# Altium schematic sheet 04 POWER.SchDoc
size 420 x 297 mm
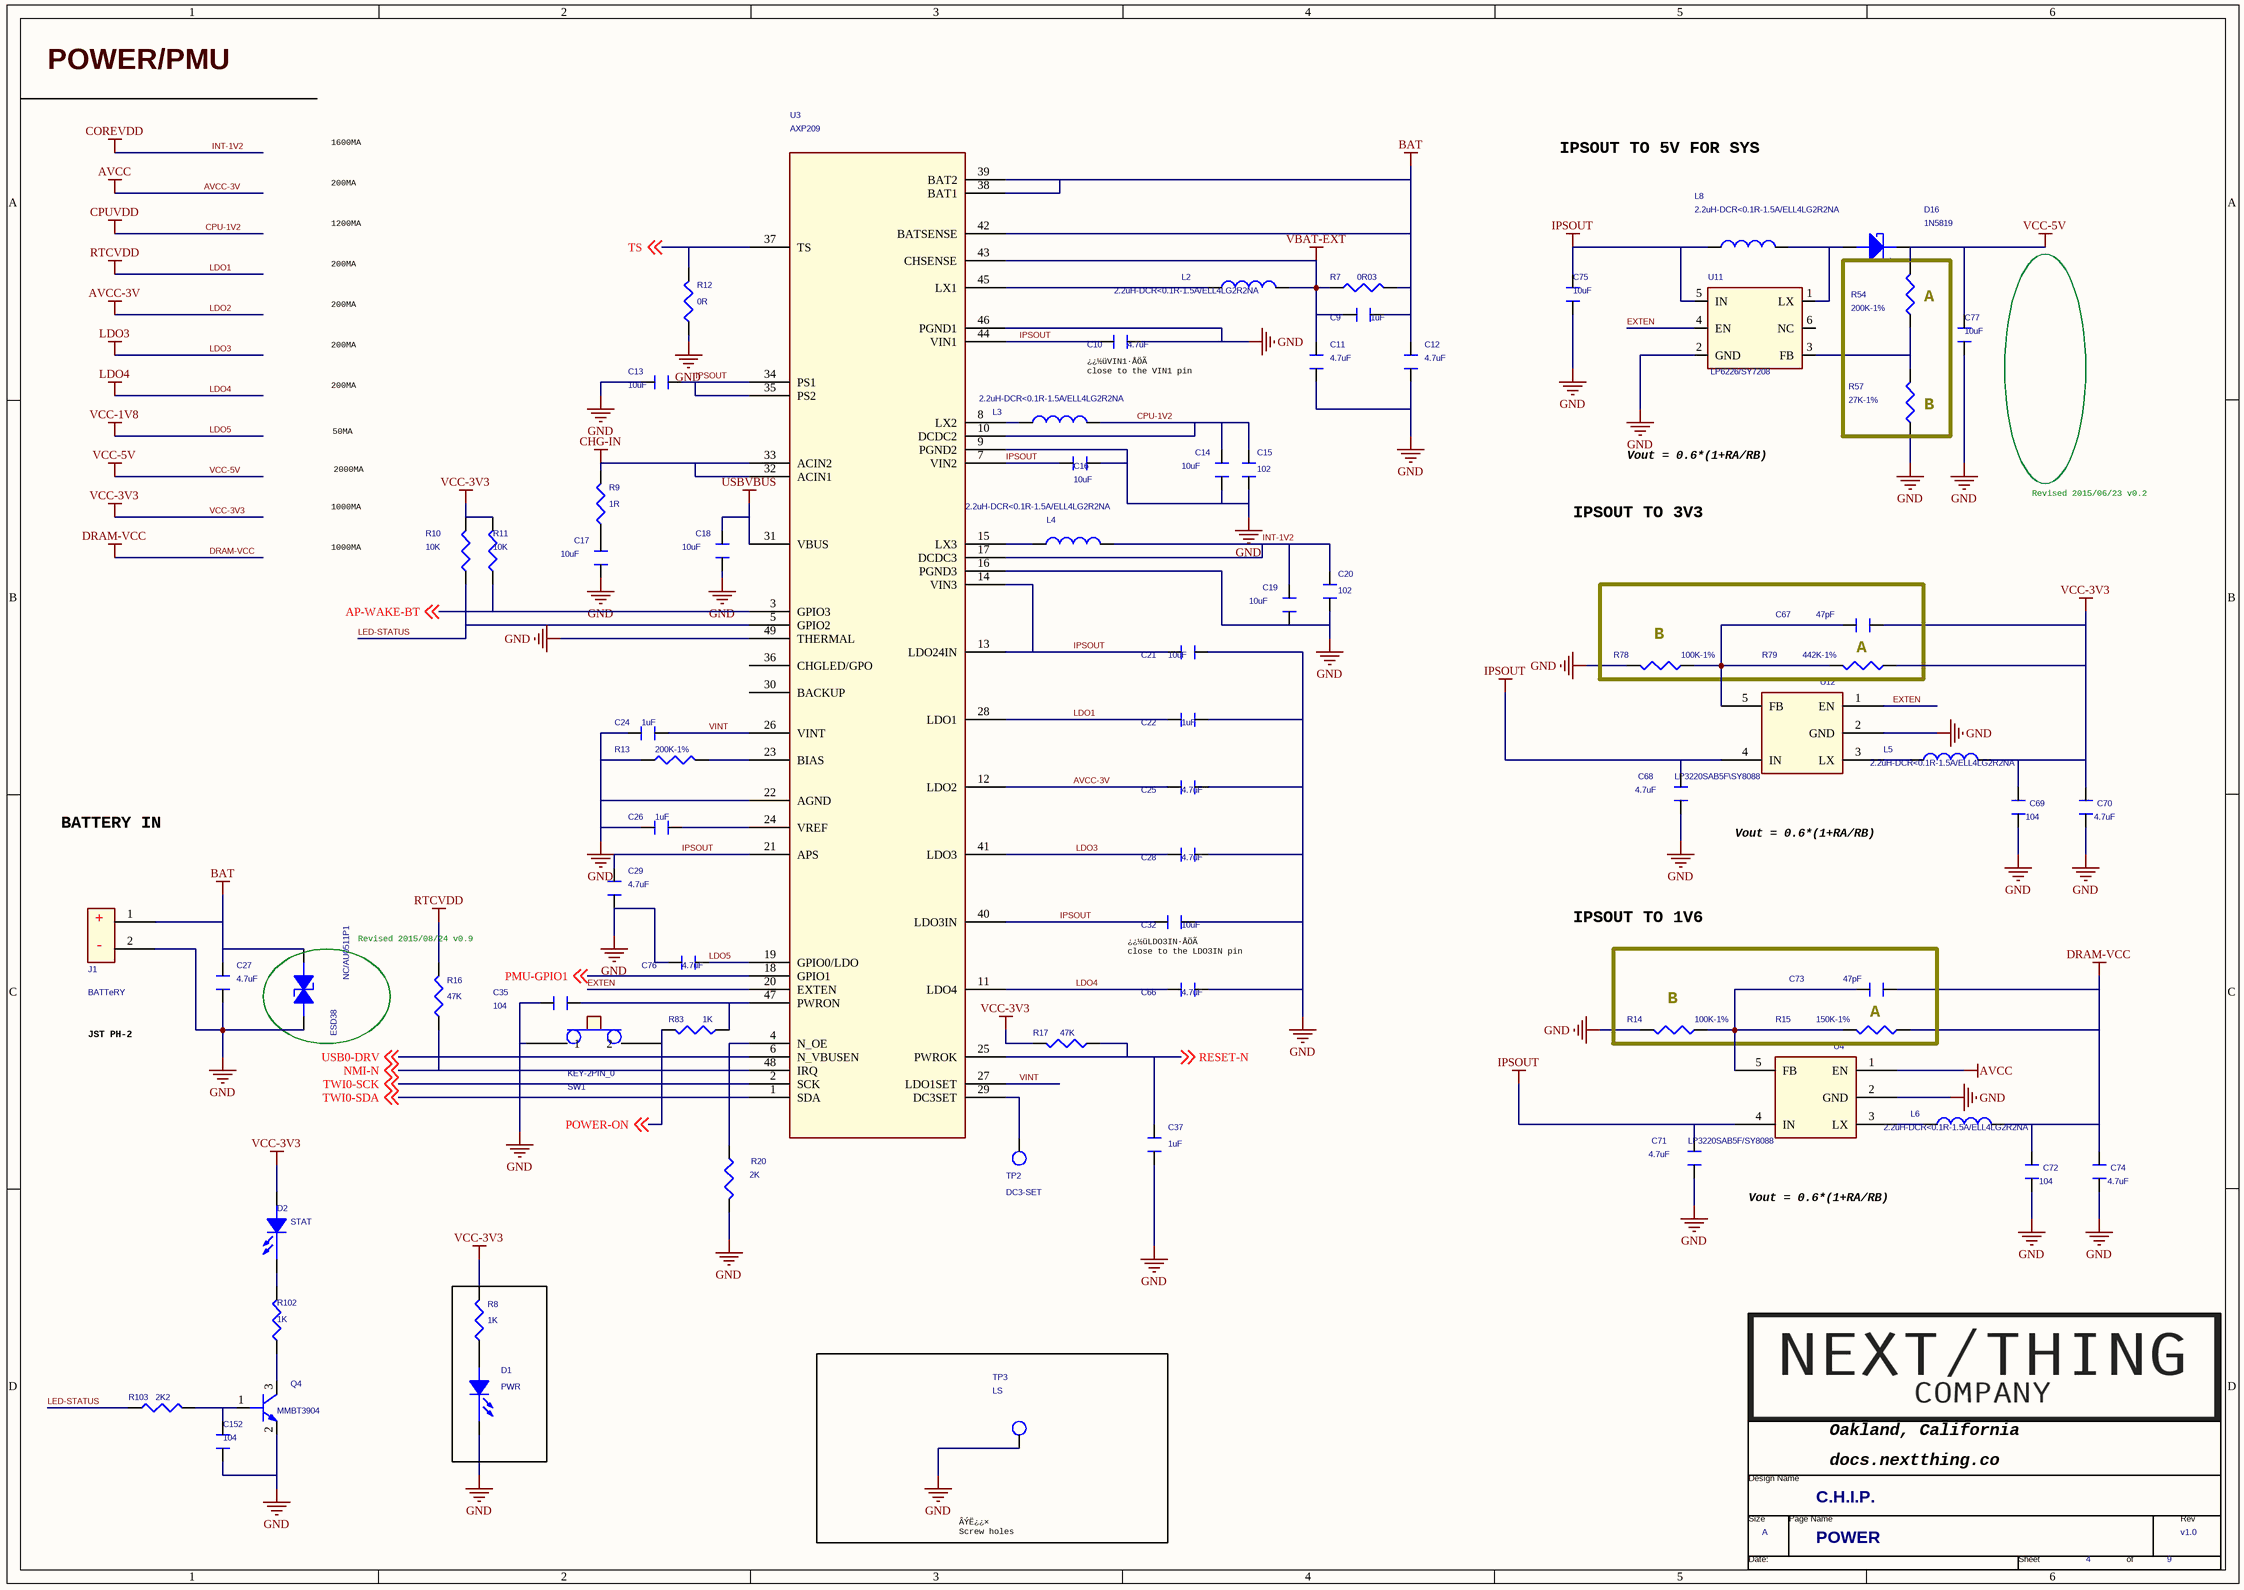
[diagram p0: 04 POWER.SchDoc]

## Parts
*  Page Count: 9  Page Number: 4  Page Size: A  Title: C.H.I.P.  RevCode: v1.0  Doc: POWER  (hidden comment: TitleBlock1-nextthing)  (graphical)
C9  1uF  [CC0402]
C10  4.7uF  [Cc0603]
C11  4.7uF  [CC0603]
C12  4.7uF  [CC0603]
C13  10uF  [CC0603]
C14  10uF  [CC0603]
C15  102  [CC0402]
C16  10uF  [CC0603]
C17  10uF  [CC0603]
C18  10uF  [CC0603]
C19  10uF  [CC0603]
C20  102  [C0201]
C21  10uF  [CC0603]
C22  1uF  [CC0402]
C24  1uF  [CC0402]
C25  4.7uF  [CC0603]
C26  1uF  [CC0402]
C27  4.7uF  [CC0603]
C28  4.7uF  [CC0603]
C29  4.7uF  [CC0603]
C32  10uF  [CC0603]
C35  104  [C0201]
C37  1uF  [CC0402]
C66  4.7uF  [CC0603]
C67  47pF  [C0201]
C68  4.7uF  [CC0603]
C69  104  [C0201]
C70  4.7uF  [CC0603]
C71  4.7uF  [CC0603]
C72  104  [C0201]
C73  47pF  [C0201]
C74  4.7uF  [CC0603]
C75  10uF  [CC0603]
C76  4.7uF  [CC0603]
C77  10uF  [CC0603]
C152  104  [C0201]
D1  PWR  [D0603]
D2  STAT  [D0603]
D16  1N5819  [SOD123]
ESD38  NC/AU0511P1  [R0402]
J1  BATTeRY  [CON2-PT2-6X6H4_7B]
L2  2.2uH-DCR<0.1R-1.5A/ELL4LG2R2NA  [L3518]
L3  2.2uH-DCR<0.1R-1.5A/ELL4LG2R2NA  [L3518]
L4  2.2uH-DCR<0.1R-1.5A/ELL4LG2R2NA  [L3518]
L5  2.2uH-DCR<0.1R-1.5A/ELL4LG2R2NA  [L3518]
L6  2.2uH-DCR<0.1R-1.5A/ELL4LG2R2NA  [L3518]
L8  2.2uH-DCR<0.1R-1.5A/ELL4LG2R2NA  [L3518]
Q4  MMBT3904  [SOT-23]
R7  0R03  [R0805]
R8  1K  [C0201]
R9  1R  [R0402]
R10  10K  [C0201]
R11  10K  [C0201]
R12  0R  [C0201]
R13  200K-1%  [C0201]
R14  100K-1%  [R0402]
R15  150K-1%  [R0402]
R16  47K  [C0201]
R17  47K  [C0201]
R20  2K  [C0201]
R54  200K-1%  [C0201]
R57  27K-1%  [C0201]
R78  100K-1%  [R0402]
R79  442K-1%  [R0402]
R83  1K  [C0201]
R102  1K  [C0201]
R103  2K2  [C0201]
SW1  KEY-2PIN_0  [KEY-2]
TP2  DC3-SET  [TP40_SMD]
TP3  LS  [PAD5_5D3]
U3  AXP209  [QFN49_0_4H0_8A]
U4  LP3220SAB5F/SY8088  [TSOT-23-6]
U11  LP6226/SY7208  [SOT23-6]
U12  LP3220SAB5F\SY8088  [TSOT-23-6]

## Nets
AVCC-3V: C25.1 U3.12(LDO2) U4.1(EN)  [also labelled AVCC, LDO2]
BAT: C9.2 C12.1 C27.2 ESD38.1(ANODE) J1.1 R7.1 U3.38(BAT1) U3.39(BAT2) U3.42(BATSENSE)
CHG-IN: R9.2 U3.32(ACIN1) U3.33(ACIN2)
CPU-1V2: C14.1 C15.1 L3.1 U3.10(DCDC2)  [also labelled CPUVDD]
DRAM-VCC: C72.1 C73.1 C74.1 L6.1 R15.2
GND: C10.2 C11.2 C12.2 C13.1 C14.2 C15.2 C16.2 C17.2 C18.2 C19.2 C20.2 C21.2 C22.1 C24.2 C25.2 C26.1 C27.1 C28.1 C29.2 C32.2 C35.1 C37.1 C66.1 C68.2 C69.2 C70.2 C71.2 C72.2 C74.2 C75.2 C76.2 C77.2 C152.1 D1.2(CATHODE) ESD38.2(CATHODE) J1.2 Q4.2(E) R12.1 R13.1 R14.1 R20.2 R57.1 R78.1 SW1.1 TP3.1(TP) U3.9(PGND2) U3.16(PGND3) U3.22(AGND) U3.46(PGND1) U3.49(THERMAL) U4.2(GND) U11.2(GND) U12.2(GND)
INT-1V2: C19.1 C20.1 L4.1 U3.17(DCDC3)  [also labelled COREVDD]
IPSOUT: C10.1 C13.2 C16.1 C21.1 C29.1 C32.1 C68.1 C71.1 C75.1 L8.1 U3.7(VIN2) U3.13(LDO24IN) U3.14(VIN3) U3.21(APS) U3.34(PS1) U3.35(PS2) U3.40(LDO3IN) U3.44(VIN1) U4.4(IN) U11.5(IN) U12.4(IN)
LDO1: C22.2 R16.2 U3.28(LDO1)  [also labelled RTCVDD]
LDO3: C28.2 U3.41(LDO3)
LDO4: C66.2 U3.11(LDO4)
LDO5: C76.1 U3.19(GPIO0/LDO)  [also labelled VCC-1V8]
USBVBUS: C18.1 U3.31(VBUS)
VBAT-EXT: C9.1 C11.1 L2.1 R7.2 U3.43(CHSENSE)
VCC-3V3: C67.1 C69.1 C70.1 D2.1(ANODE) L5.1 R8.2 R10.2 R11.2 R17.2 R79.2
VCC-5V: C77.1 D16.2 R54.2
AP-WAKE-BT: R11.1 U3.3(GPIO3) ; off-sheet AP-WAKE-BT
EXTEN: U3.20(EXTEN) U11.4(EN) U12.1(EN)
LED-STATUS: R10.1 R103.2 U3.5(GPIO2)
NMI-N: R16.1 U3.48(IRQ) ; off-sheet NMI-N
PMU-GPIO1: U3.18(GPIO1) ; off-sheet PMU-GPIO1
POWER-ON: R83.2 SW1.2 ; off-sheet POWER-ON
RESET-N: C37.2 R17.1 U3.25(PWROK) ; off-sheet RESET-N
TS: R12.2 U3.37(TS) ; off-sheet TS
TWI0-SCK: U3.2(SCK) ; off-sheet TWI0-SCK
TWI0-SDA: U3.1(SDA) ; off-sheet TWI0-SDA
USB0-DRV: U3.6(N_VBUSEN) ; off-sheet USB0-DRV
VINT: C24.1 U3.26(VINT) U3.27(LDO1SET)
NetC17_1: C17.1 R9.1
NetC26_2: C26.2 U3.24(VREF)
NetC35_2: C35.2 R83.1 U3.47(PWRON)
NetC67_2: C67.2 R78.2 R79.1 U12.5(FB)
NetC73_2: C73.2 R14.2 R15.1 U4.5(FB)
NetC152_2: C152.2 Q4.1(B) R103.1
NetD1_1: D1.1(ANODE) R8.1
NetD2_2: D2.2(CATHODE) R102.1
NetD16_1: D16.1 L8.2 U11.1(LX)
NetL2_2: L2.2 U3.45(LX1)
NetL3_2: L3.2 U3.8(LX2)
NetL4_2: L4.2 U3.15(LX3)
NetL5_2: L5.2 U12.3(LX)
NetL6_2: L6.2 U4.3(LX)
NetQ4_3: Q4.3(C) R102.2
NetR13_2: R13.2 U3.23(BIAS)
NetR20_1: R20.1 U3.4(N_OE)
NetR54_1: R54.1 R57.2 U11.3(FB)
NetTP2_1: TP2.1(TP) U3.29(DC3SET)

Not connected (* = marked no-connect by the designer): U3 30(BACKUP) 36(CHGLED/GPO); U11 6(NC)

## Notes on the sheet
- POWER/PMU
- 200MA
- 1600MA
- IPSOUT TO 5V FOR SYS
- 1200MA
- (near R54) A
- (near C10) ¿¿½üVIN1·ÅÖÃ
  close to the VIN1 pin
- 50MA
- Vout = 0.6*(1+RA/RB)
- (near R57) B
- 1000MA
- 2000MA
- IPSOUT TO 3V3
- Revised 2015/06/23 v0.2
- (near R78) B
- A
- BATTERY IN
- (near J1) +
- (near C32) ¿¿½üLDO3IN·ÅÖÃ
  close to the LDO3IN pin
- IPSOUT TO 1V6
- (near J1) -
- (near R16) Revised 2015/08/24 v0.9
- (near R14) B
- JST PH-2
- ÂÝË¿¿×
  Screw holes
- (in symbol TitleBlock1-nextthing) Oakland, California; Design Name; docs.nextthing.co /; Size; Page Name; Rev; Date:; Sheet; of

## Library data of the parts
C9-C14 C16-C19 C21 C22 C24-C26 C28 C29 C32 C35 C37 C66 C76 = CAPACITOR_0_Dup2: PAGE: 1
C15 C20 = CAPACITOR_1: PAGE: 1
C27 = CAPACITOR_0_Dup4: PAGE: 1
C67-C75 C77 = CAPACITOR_0_Dup1: PAGE: 1
C152 = CAPACITOR_0_Dup4: PAGE: 3; ROOM: MODEM
D1 = LED_0: PAGE: 1
D2 = LED_0: ROOM: MODEM; PAGE: 1
D16 = DIODE_SCHOTTKY_0
ESD38 = 1_1.5KE100A: 1ST PART DESCRIPTION: WILL ESD9B5V Bidirection ESD Protection
J1 = CON3_0
L2-L4 L8 = INDUCTOR_1_Dup1
L5 L6 = INDUCTOR_0
Q4 = NPN: ROOM: MODEM
R7 = R: PAGE: 1
R8-R13 R16 R17 R20 R83 = R_Dup1
R14 R15 R78 R79 = ?_0_Dup1
R54 R57 = R_Dup2
R102 R103 = RESISTOR_Dup1: ROOM: MODEM
TP2 TP3 = T_POINT_R_Dup1
U3 = AW1612_0
U4 U12 = RT9293B_0
U11 = RT9266PE_3
* = TitleBlock1-nextthing: Page Create Date: March  8, 1995